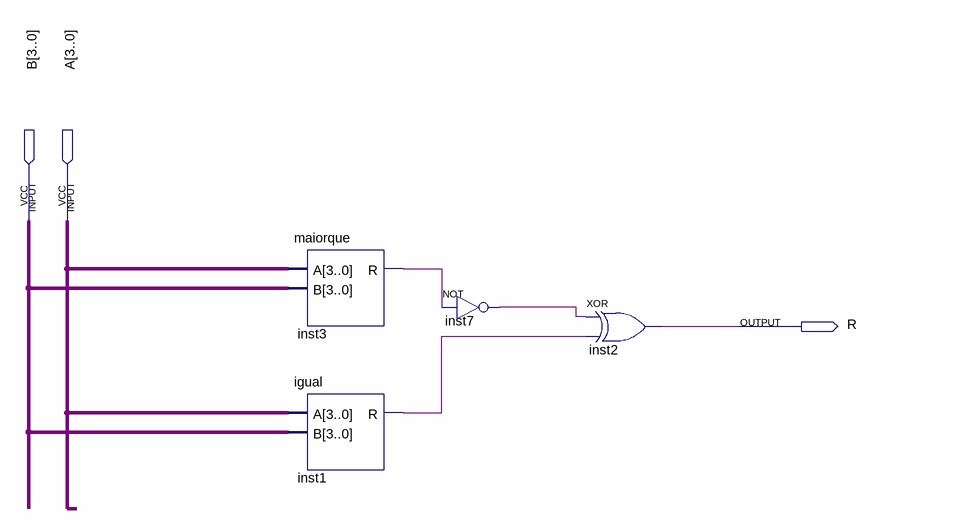
[diagram p0: schematic sheet]
// Quartus schematic menorque.bdf as structural Verilog: 4 symbols, 3 pins
module menorque (
  input  [3:0] B,
  input  [3:0] A,
  output R
);

  wire inst1_r, inst3_r, inst7_out;

  maiorque inst3 (.A(A), .B(B), .R(inst3_r));
  igual inst1 (.A(A), .B(B), .R(inst1_r));
  not inst7 (inst7_out, inst3_r);
  xor inst2 (R, inst7_out, inst1_r);
endmodule
